# Altium schematic sheet sensorbar.SchDoc
size A
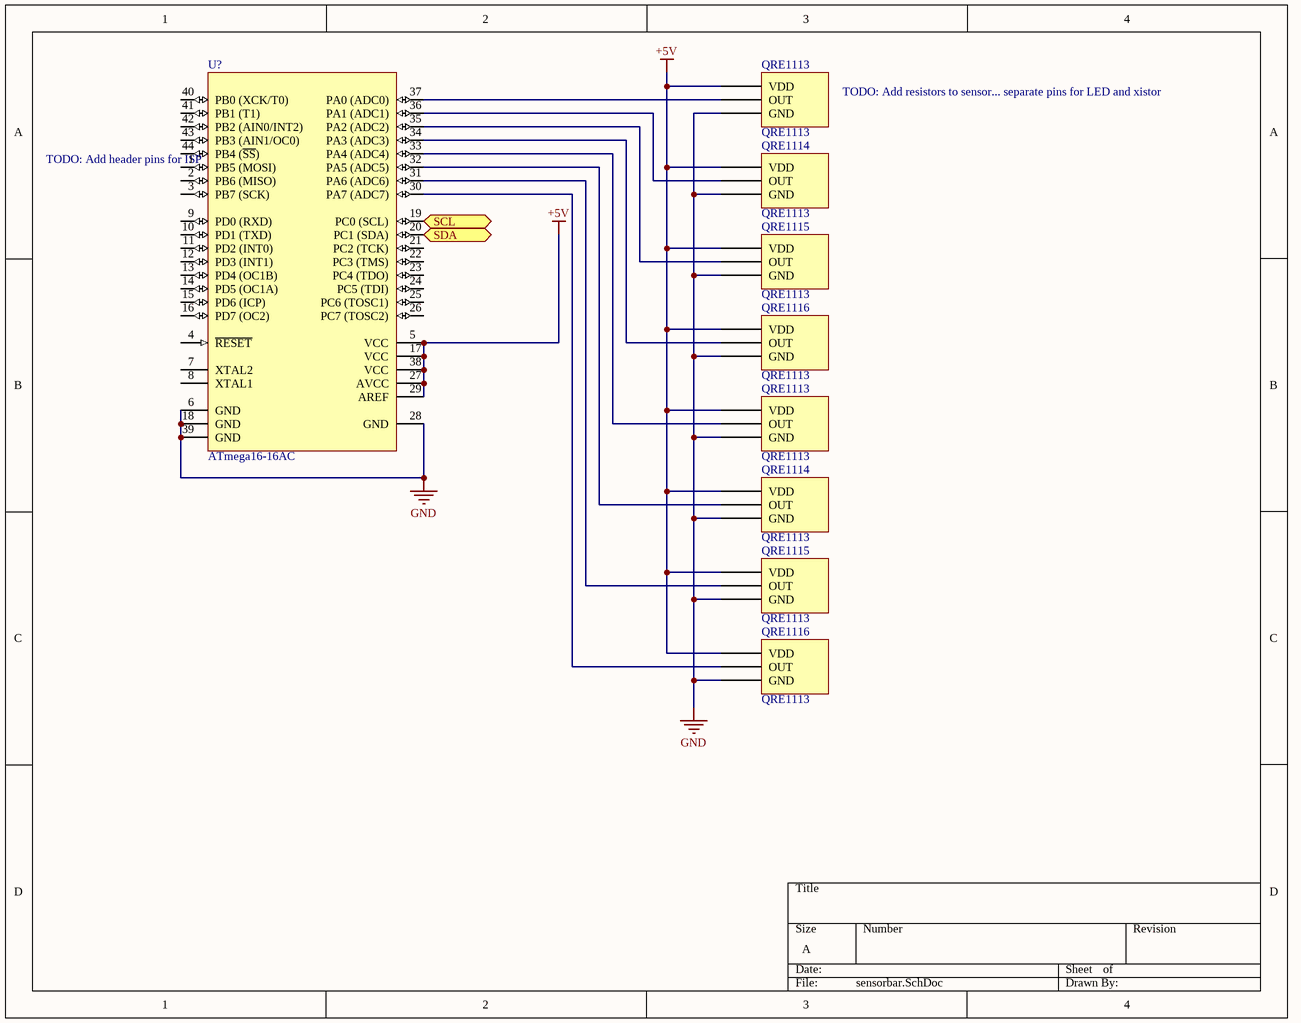
[diagram p0: sensorbar.SchDoc]

## Parts
(Parts that share a designator on the sheet are numbered #1, #2 ... from top to bottom, then left to right.)
QRE1113#1  QRE1113
QRE1113#2  QRE1113
QRE1114#1  QRE1113
QRE1114#2  QRE1113
QRE1115#1  QRE1113
QRE1115#2  QRE1113
QRE1116#1  QRE1113
QRE1116#2  QRE1113
U?  ATmega16-16AC  [44A_N]

## Ports
SCL (out), SDA (out)

## Nets
+5V: QRE1113#1.VDD QRE1113#2.VDD QRE1114#1.VDD QRE1114#2.VDD QRE1115#1.VDD QRE1115#2.VDD QRE1116#1.VDD QRE1116#2.VDD U?.5(VCC) U?.17(VCC) U?.27(AVCC) U?.29(AREF) U?.38(VCC)
GND: QRE1113#1.GND QRE1113#2.GND QRE1114#1.GND QRE1114#2.GND QRE1115#1.GND QRE1115#2.GND QRE1116#1.GND QRE1116#2.GND U?.6(GND) U?.18(GND) U?.28(GND) U?.39(GND)
SCL: U?.19(PC0_(SCL)) ; port SCL
SDA: U?.20(PC1_(SDA)) ; port SDA
NetQRE1113#1_OUT: QRE1113#1.OUT U?.37(PA0_(ADC0))
NetQRE1113#2_OUT: QRE1113#2.OUT U?.33(PA4_(ADC4))
NetQRE1114#1_OUT: QRE1114#1.OUT U?.36(PA1_(ADC1))
NetQRE1114#2_OUT: QRE1114#2.OUT U?.32(PA5_(ADC5))
NetQRE1115#1_OUT: QRE1115#1.OUT U?.35(PA2_(ADC2))
NetQRE1115#2_OUT: QRE1115#2.OUT U?.31(PA6_(ADC6))
NetQRE1116#1_OUT: QRE1116#1.OUT U?.34(PA3_(ADC3))
NetQRE1116#2_OUT: QRE1116#2.OUT U?.30(PA7_(ADC7))

Not connected (* = marked no-connect by the designer): U? 1(PB5_(MOSI)) 2(PB6_(MISO)) 3(PB7_(SCK)) 4(~{RESET}) 7(XTAL2) 8(XTAL1) 9(PD0_(RXD)) 10(PD1_(TXD)) 11(PD2_(INT0)) 12(PD3_(INT1)) 13(PD4_(OC1B)) 14(PD5_(OC1A)) 15(PD6_(ICP)) 16(PD7_(OC2)) 21(PC2_(TCK)) 22(PC3_(TMS)) 23(PC4_(TDO)) 24(PC5_(TDI)) 25(PC6_(TOSC1)) 26(PC7_(TOSC2)) 40(PB0_(XCK/T0)) 41(PB1_(T1)) 42(PB2_(AIN0/INT2)) 43(PB3_(AIN1/OC0)) 44(PB4_(~{SS}))

## Notes on the sheet
- TODO: Add resistors to sensor... separate pins for LED and xistor
- (near U?) TODO: Add header pins for ISP

## Library data of the parts
QRE1113#1 QRE1113#2 QRE1114#1 QRE1114#2 QRE1115#1 QRE1115#2 QRE1116#1 QRE1116#2 = QRE1113: Object Sensor
U? = ATmega16-16AC: 8-Bit AVR Microcontroller with 16K Bytes of In-System Programmable Flash Memory; Published: 17-Sep-2003; LatestRevisionDate: 13-Apr-2006; LatestRevisionNote: IPC-7351 Footprint Added.; DatasheetVersion: 2466E-AVR-10/02; PackageVersion: rev.B, Oct-2001; PackageReference: 44A; Publisher: Altium Limited; PackageDescription: 44-Pin Thin Quad Flat Pack 0.8 mm Pitch; ComponentLink1Description: Manufacturer Link; ComponentLink1URL: http://www.atmel.com; ComponentLink2Description: Datasheet; ComponentLink2URL: http://www.atmel.com/dyn/resources/prod_documents/doc2466.pdf